# EAGLE schematic controller (EAGLE 9.6.2)
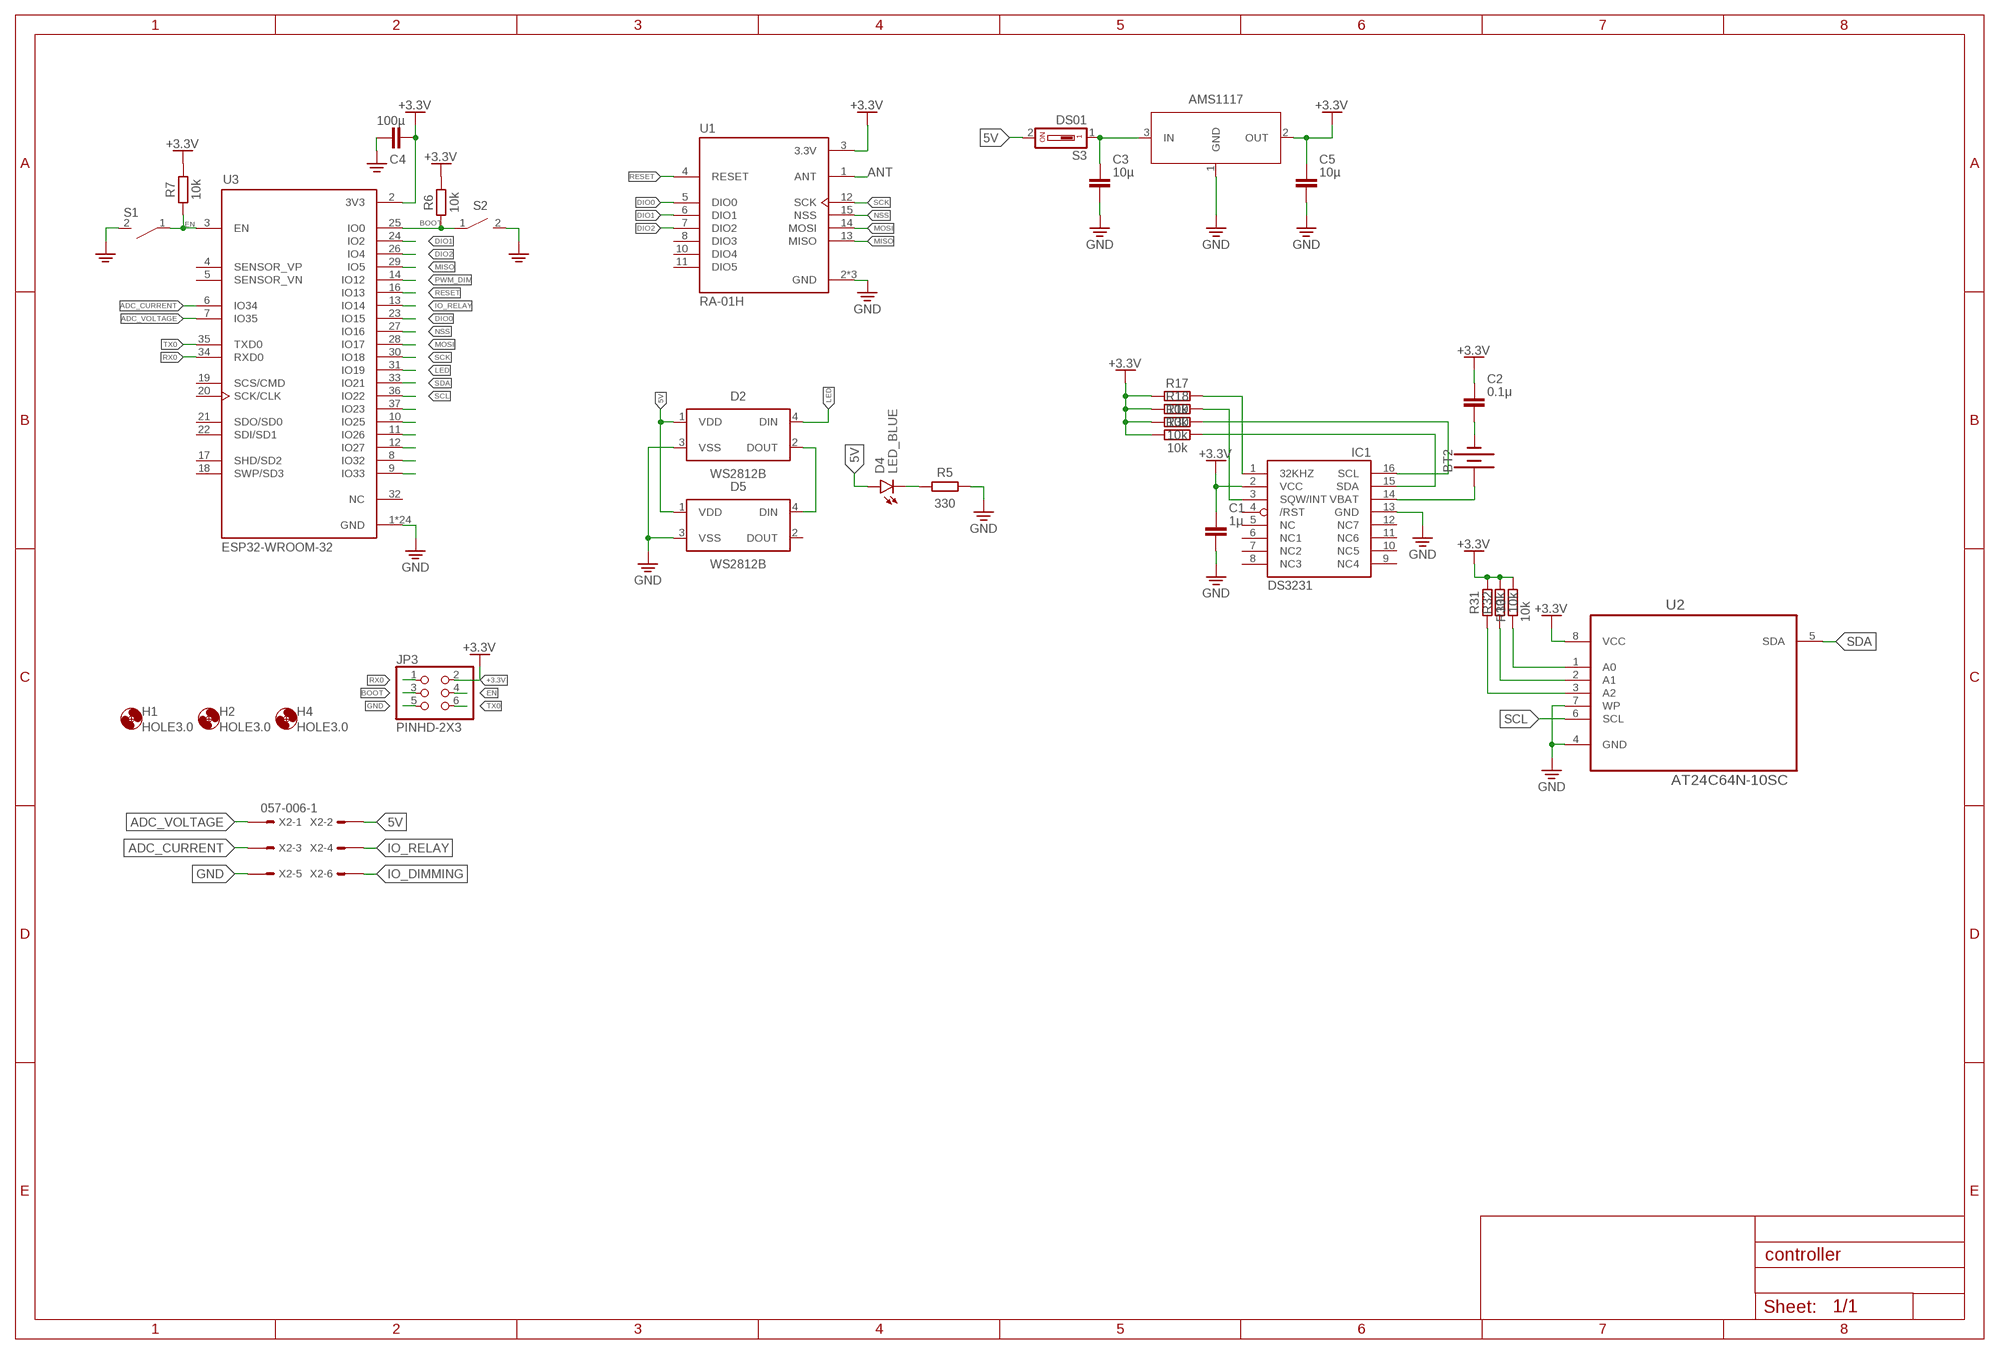
[diagram p0: schematic, sheet 1]

## Parts
AMS1117  NCP1117ST33T3G  NCP1117ST33T3GSOT-223  [SOT230P700X170-4]
BT2  BATTERY-20MM_PTH  [BATTCOM_20MM_PTH]
C1  1μ  C_CHIP-0603(1608-METRIC)  [CAPC1608X85]
C2  0.1μ  C_CHIP-0603(1608-METRIC)  [CAPC1608X85]
C3  10µ  C_CHIP-0603(1608-METRIC)  [CAPC1608X85]
C4  100µ  C_TANTALUM-2412(6032-METRIC)  [CAPM6032X280]
C5  10µ  C_CHIP-0603(1608-METRIC)  [CAPC1608X85]
D2  WS2812B  [WS2812B]
D4  LED_BLUE  CHIP-FLAT-B_0603-0.55MM  [LEDC1608X55N_FLAT-B]
D5  WS2812B  [WS2812B]
H1  HOLE3.0  MOUNT-HOLE3.0  [3,0]
H2  HOLE3.0  MOUNT-HOLE3.0  [3,0]
H4  HOLE3.0  MOUNT-HOLE3.0  [3,0]
IC1  DS3231/SO  [SO16W]
JP3  PINHD-2X3  [2X03]
R5  330  R_CHIP-0603(1608-METRIC)  [RESC1608X60]
R6  10k  R_CHIP-0603(1608-METRIC)  [RESC1608X60]
R7  10k  R_CHIP-0603(1608-METRIC)  [RESC1608X60]
R17  10k  R-EU_R1206  [R1206]
R18  10k  R-EU_R1206  [R1206]
R19  10k  R-EU_R1206  [R1206]
R30  10k  R-EU_R1206  [R1206]
R31  10k  R-EU_R1206  [R1206]
R32  10k  R-EU_R1206  [R1206]
R33  10k  R-EU_R1206  [R1206]
S1  B3U-X000B3U-1000P(M)1000P(M)  [B3U-1000P(M)]
S2  B3U-X000B3U-1000P(M)1000P(M)  [B3U-1000P(M)]
S3  DS01  [DS-01]
U1  RA-01H  [RA-01H]
U2  AT24C64N-10SC  [SOIC127P600X175-8N]
U3  ESP32-WROOM-32  [MODULE_ESP32-WROOM-32]
X2  057-006-1  [057-006-1]

## Nets
5V: D2.1(VDD) D4.A D5.1(VDD) S3.2 X2.2
+3.3V: AMS1117.2(OUT) C1.1 C2.1 C4.1 C5.1 IC1.2(VCC) JP3.2 R6.2 R7.2 R17.1 R18.1 R19.1 R30.1 R31.2 R32.2 R33.2 U1.3(3.3V) U2.8(VCC) U3.2(3V3)
ADC_CURRENT: U3.6(IO34) X2.3
ADC_VOLTAGE: U3.7(IO35) X2.1
ANT: U1.1(ANT)
BOOT: JP3.3 R6.1 S2.1 U3.25(IO0)
DIO0: U1.5(DIO0) U3.23(IO15)
DIO1: U1.6(DIO1) U3.24(IO2)
DIO2: U1.7(DIO2) U3.26(IO4)
EN: JP3.4 R7.1 S1.1 U3.3(EN)
GND: C1.2 C3.2 C4.2 C5.2 D2.3(VSS) D5.3(VSS) IC1.13(GND) JP3.5 R5.2 S1.2 S2.2 U1.2(GND) U1.9(GND) U1.16(GND) U2.4(GND) U2.7(WP) U3.1(GND) U3.15(GND) U3.38(GND) U3.39_1(GND) U3.39_2(GND) U3.39_3(GND) U3.39_4(GND) U3.39_5(GND) U3.39_6(GND) U3.39_7(GND) U3.39_8(GND) U3.39_9(GND) U3.39_10(GND) U3.39_11(GND) U3.39_12(GND) U3.39_13(GND) U3.39_14(GND) U3.39_15(GND) U3.39_16(GND) U3.39_17(GND) U3.39_18(GND) U3.39_19(GND) U3.39_20(GND) U3.39_21(GND) X2.5
IO_DIMMING: X2.6
IO_RELAY: U3.13(IO14) X2.4
LED: D2.4(DIN) U3.31(IO19)
MISO: U1.13(MISO) U3.29(IO5)
MOSI: U1.14(MOSI) U3.28(IO17)
N$5: R33.1 U2.1(A0)
N$6: R32.1 U2.2(A1)
N$10: R31.1 U2.3(A2)
N$14: D2.2(DOUT) D5.4(DIN)
N$19: BT2.1(+) IC1.14(VBAT)
N$20: IC1.3(SQW/INT) R18.2
N$21: IC1.1(32KHZ) R17.2
N$23: BT2.2(-) C2.2
N$25: D4.C R5.1
N$26: AMS1117.3(IN) C3.1 S3.1
N$33: AMS1117.1(GND) ; supply symbol labelled GND
N$41: U3.37(IO23)
N$42: U3.10(IO25)
N$43: U3.11(IO26)
N$44: U3.12(IO27)
N$45: U3.8(IO32)
N$46: U3.9(IO33)
NSS: U1.15(NSS) U3.27(IO16)
PWM_DIM: U3.14(IO12)
RESET: U1.4(RESET) U3.16(IO13)
RX0: JP3.1 U3.34(RXD0)
SCK: U1.12(SCK) U3.30(IO18)
SCL: IC1.16(SCL) R19.2 U2.6(SCL) U3.36(IO22)
SDA: IC1.15(SDA) R30.2 U2.5(SDA) U3.33(IO21)
TX0: JP3.6 U3.35(TXD0)
Unconnected: D5.2(DOUT) IC1.4(/RST) IC1.5(NC) IC1.6(NC1) IC1.7(NC2) IC1.8(NC3) IC1.9(NC4) IC1.10(NC5) IC1.11(NC6) IC1.12(NC7) U1.8(DIO3) U1.10(DIO4) U1.11(DIO5) U3.4(SENSOR_VP) U3.5(SENSOR_VN) U3.17(SHD/SD2) U3.18(SWP/SD3) U3.19(SCS/CMD) U3.20(SCK/CLK) U3.21(SDO/SD0) U3.22(SDI/SD1) U3.32(NC)

## Library data of the parts
AMS1117 = IC_Power-Management:NCP1117ST33T3G: 1.0 A Low-Dropout Positive Fixed and Adjustable Voltage Regulators Datasheet <https://www.onsemi.com/pub/Collateral/NCP1117-D.PDF>; CATEGORY: IC_Power-Management; MANUFACTURER: ON Semiconductor; MPN: NCP1117ST33T3G; OPERATING_TEMP: 0 to +125 °C; PART_STATUS: Active; ROHS_COMPLIANT: RoHS3 Compliant; SERIES: NCP1117, NCV1117; SUB-CATEGORY: Voltage Regulator; TYPE: Linear
BT2 = SparkFun-Batteries:BATTERY: Battery - Single Cell A variety of battery chemistries, sizes, and footprints. Device List: 20MM_PTH - Coin Cell Battery Holder - 20mm (PTH) <https://www.sparkfun.com/products/783> 20MM_PTH_KIT- Coin Cell battery Holder - 20 mm (PTH) <http://www.sparkfun.com/products/783>kit version with special mask 6.8MM_PTH - Coin Cell Battery Holder - 6.8MM(SMD) <https://www.digikey.com/product-detail/en/seiko-instruments/MS621FE-FL11E/728-1057-ND/1889208?WT.srch=1&gclid=CNOQ5a6LzdQCFZS2wAodXCkE0g> 12MM_SMD - Coin Cell Battery Holder - 12mm (SMD) <https://www.sparkfun.com/products/10592> 12MM_PTH - Coin Cell Battery Holder - 12mm (PTH) <https://www.sparkfun.com/products/7948> 20MM_SMD - 20mm Coin Cell Battery Holder (SMD) (2 legs) Used on the Big Time Watch Kit <https://www.sparkfun.com/products/11734> 20MM_SMD_4LEGS - Coin Cell Battery Holder - 20mm (SMD) <https://www.sparkfun.com/products/11892> 20MM_SMD_4LEGS_OVERPASTE - Coin Cell Battery Holder - 20mm (SMD) <https://www.sparkfun.com/products/11892> (Over-paste on the legs) 24.5MM_PTH - Coin Cell Battery Holder - 24.5mm (PTH) <https://www.sparkfun.com/products/8863> 9V - 9V Battery Holder - PC Mount Used on the SparkFun SparkPunk Sound Kit <https://www.sparkfun.com/products/11177> and SparkFun SparkPunk Sequencer Kit <https://www.sparkfun.com/products/12707> 18650 - Battery Holder - 18650 (PTH) <https://www.sparkfun.com/products/13113> AA - Battery Holder - 1xAA (PTH) <https://www.sparkfun.com/products/7949> AAA - Battery Holder - 1xAAA (PTH) <https://www.sparkfun.com/products/12718> AA_KIT - Battery Holder - 1xAA (PTH) <https://www.sparkfun.com/products/7949> Special kit package - pads only have exposed copper on one side of the board. AAA_KIT - Battery Holder - 1xAAA (PTH) <https://www.sparkfun.com/products/12718> Special kit package - pads only have exposed copper on one side of the board.; PROD_ID: BATT-09031; SF_SKU: PRT-00783
C1-C5 = Capacitor:C: Capacitor - Generic; CATEGORY: Capacitor
D2 D5 = LED:WS2812B: Intelligent control LED integrated light source Datasheet <http://cdn.sparkfun.com/datasheets/BreakoutBoards/WS2812B.pdf>; CATEGORY: LED; COLOR: RGB; DESCRIPTION: LED integrated light source; MANUFACTURER: Worldsemi; MPN: WS2812B; OPERATING_TEMP: -25 ℃ to +80℃(TJ); PART_STATUS: Active; SUB_CATEGORY: RGB
D4 = LED:CHIP-FLAT-B; CATEGORY: LED; COLOR: BLUE; DESCRIPTION: CHIP LED FLAT; SUB-CATEGORY: CHIP; TYPE: FLAT_TOP
H1 H2 H4 = holes:MOUNT-HOLE: MOUNTING HOLE with drill center marker
IC1 = XLKM#4:DS3231
JP3 = Connector:PINHD-2X3: PIN HEADER; CATEGORY: CONNECTOR; SUB-CATEGORY: PIN-HEADER
R5-R7 = Resistor:R: Resistor Fixed - Generic; CATEGORY: Resistor; SUB-CATEGORY: Fixed
R17-R19 R30-R33 = rcl:R-EU_: RESISTOR, European symbol; SPICEPREFIX: R
S1 S2 = Switch:B3U-X000: Ultra-small Tactile Switch Contact form : SPST-NO Datasheet <https://omronfs.omron.com/en_US/ecb/products/pdf/en-b3u.pdf>; CATEGORY: SWITCH; DESCRIPTION: Ultra-small Surface-mounting Tactile Switches with High Contact Reliability; MANUFACTURER: OMRON; OPERATING_TEMPERATURE: -25°C to +70°C at 60%RH max; PART_STATUS: ACTIVE; ROHS_COMPLIANCE: RoHS Compliant; SERIES: B3U; TYPE: Tactile; VALUE: B3U-1000P(M)
S3 = Switch:DS01: DIL/CODE SWITCH; CATEGORY: SWITCH; TYPE: SPST
U1 = XLKM#4:RA-01H: Ai-Thinker Lora Series Module; MANUFACTURER: AI-Thinker; MAXIMUM_PACKAGE_HEIGHT: 3.4mm; PARTREV: V1.0; STANDARD: Manufacturer Recommendations
U2 = XLKM#4:AT24C64N-10SC: Two-wire Serial EEPROM; MPN: AT24C64N-10SC; OC_FARNELL: 1362658; OC_NEWARK: -; PACKAGE: SOIC-8; SUPPLIER: Atmel
U3 = XLKM#4:ESP32-WROOM-32; MANUFACTURER: Espressif Systems; MAXIMUM_PACKAGE_HEIGHT: 3.2 mm; PARTREV: 2.9; STANDARD: Manufacturer Recommendations
X2 = con-panduit:057-006-: CONNECTOR 6-pin series 057 contact pc board low profile headers; OC_FARNELL: unknown; OC_NEWARK: unknown